# EAGLE design HeartRate Sensor (EAGLE 9.5.1)
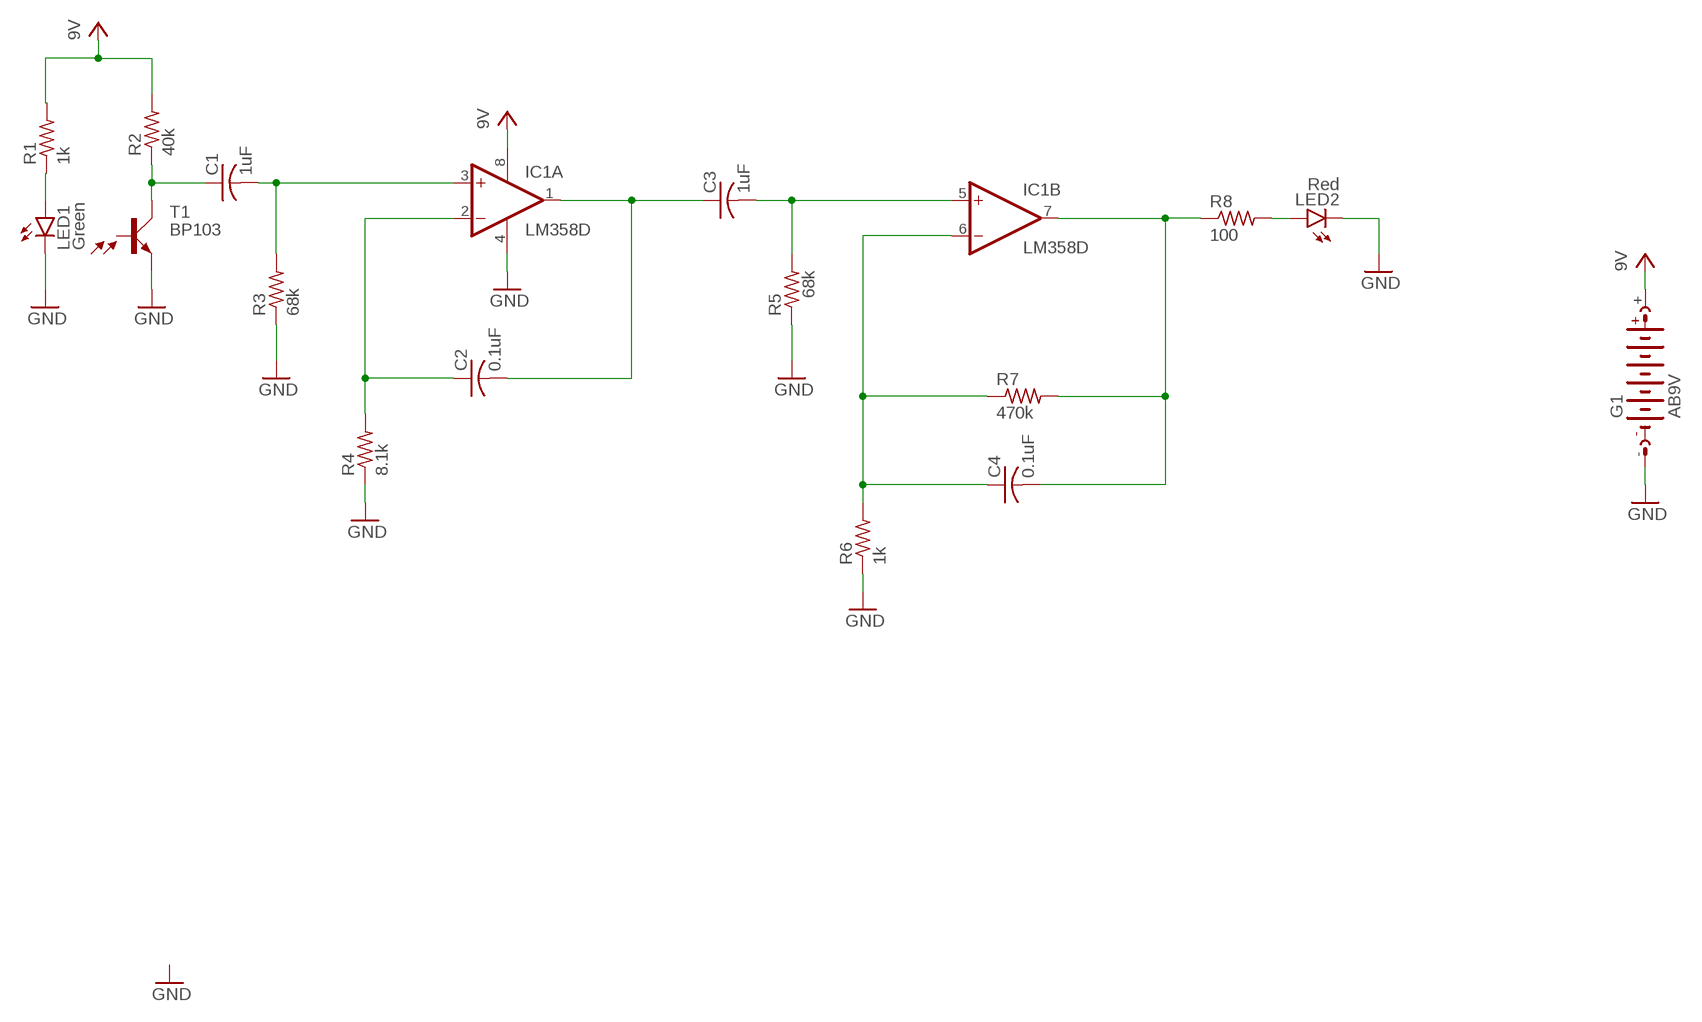
[diagram p0: schematic, sheet 1]

## Parts
C1  1uF  C-USC0805  [C0805]
C2  0.1uF  C-USC0805  [C0805]
C3  1uF  C-USC0805  [C0805]
C4  0.1uF  C-USC0805  [C0805]
G1  AB9V  [AB9V]
IC1  LM358D  [SO08]
LED1  Green  LED  [SMARTLED-TTW]
LED2  Red  LED  [SMARTLED-TTW]
R1  1k  R-US_R0805  [R0805]
R2  40k  R-US_R0805  [R0805]
R3  68k  R-US_R0805  [R0805]
R4  8.1k  R-US_R0805  [R0805]
R5  68k  R-US_R0805  [R0805]
R6  1k  R-US_R0805  [R0805]
R7  470k  R-US_R0805  [R0805]
R8  100  R-US_R0805  [R0805]
T1  BP103  [BP103]

## Nets
GND: G1.- IC1.4(P:V-) LED1.C@1(C) LED2.C@1(C) R3.1 R4.1 R5.1 R6.1 T1.E
N$1: C1.2 IC1.3(A:+IN) R3.2
N$2: C2.1 IC1.2(A:-IN) R4.2
N$3: C3.2 IC1.5(B:+IN) R5.2
N$4: C2.2 C3.1 IC1.1(A:OUT)
N$5: C4.1 IC1.6(B:-IN) R6.2 R7.1
N$6: C4.2 IC1.7(B:OUT) R7.2 R8.1
N$7: LED2.A@1(A) R8.2
N$8: LED1.A@1(A) R1.1
N$9: C1.1 R2.1 T1.C
VCC: G1.+ IC1.8(P:V+) R1.2 R2.2 ; supply symbol labelled 9V
Unconnected: T1.B

## Library data of the parts
C1-C4 = rcl:C-US: CAPACITOR, American symbol; SPICEPREFIX: C
G1 = battery:AB9V: 9-V BATTERY CLIP
IC1 = linear:LM358: OP AMP also LM158; LM258; LM2904 Source: http://cache.national.com/ds/LM/LM158.pdf
LED1 LED2 = led:LED: LED OSRAM: - CHIPLED LG R971, LG N971, LY N971, LG Q971, LY Q971, LO R971, LY R971 LH N974, LH R974 LS Q976, LO Q976, LY Q976 LO Q996 - Hyper CHIPLED LW Q18S LB Q993, LB Q99A, LB R99A - SideLED LS A670, LO A670, LY A670, LG A670, LP A670 LB A673, LV A673, LT A673, LW A673 LH A674 LY A675 LS A676, LA A676, LO A676, LY A676, LW A676 LS A679, LY A679, LG A679 - Hyper Micro SIDELED® LS Y876, LA Y876, LO Y876, LY Y876 LT Y87S - SmartLED LW L88C, LW L88S LB L89C, LB L89S, LG L890 LS L89K, LO L89K, LY L89K LS L896, LA L896, LO L896, LY L896 - TOPLED LS T670, LO T670, LY T670, LG T670, LP T670 LSG T670, LSP T670, LSY T670, LOP T670, LYG T670 LG T671, LOG T671, LSG T671 LB T673, LV T673, LT T673, LW T673 LH T674 LS T676, LA T676, LO T676, LY T676, LB T676, LH T676, LSB T676, LW T676 LB T67C, LV T67C, LT T67C, LS T67K, LO T67K, LY T67K, LW E67C LS E67B, LA E67B, LO E67B, LY E67B, LB E67C, LV E67C, LT E67C LW T67C LS T679, LY T679, LG T679 LS T770, LO T770, LY T770, LG T770, LP T770 LB T773, LV T773, LT T773, LW T773 LH T774 LS E675, LA E675, LY E675, LS T675 LS T776, LA T776, LO T776, LY T776, LB T776 LHGB T686 LT T68C, LB T68C - Hyper Mini TOPLED® LB M676 - Mini TOPLED Santana® LG M470 LS M47K, LO M47K, LY M47K Source: http://www.osram.convergy.de LUXEON: - LUMILED® LXK2-PW12-R00, LXK2-PW12-S00, LXK2-PW14-U00, LXK2-PW14-V00 LXK2-PM12-R00, LXK2-PM12-S00, LXK2-PM14-U00 LXK2-PE12-Q00, LXK2-PE12-R00, LXK2-PE12-S00, LXK2-PE14-T00, LXK2-PE14-U00 LXK2-PB12-K00, LXK2-PB12-L00, LXK2-PB12-M00, LXK2-PB14-N00, LXK2-PB14-P00, LXK2-PB14-Q00 LXK2-PR12-L00, LXK2-PR12-M00, LXK2-PR14-Q00, LXK2-PR14-R00 LXK2-PD12-Q00, LXK2-PD12-R00, LXK2-PD12-S00 LXK2-PH12-R00, LXK2-PH12-S00 LXK2-PL12-P00, LXK2-PL12-Q00, LXK2-PL12-R00 Source: www.luxeon.com KINGBRIGHT: KA-3528ASYC Source: www.kingbright.com
R1-R8 = rcl:R-US_: RESISTOR, American symbol; SPICEPREFIX: R
T1 = opto-trans-siemens:BP103: PHOTO TRANSISTOR; OC_FARNELL: unknown; OC_NEWARK: unknown

## Net classes
0 default: width 0.305 mm, drill 0.508 mm, clearance 0.254 mm

## Board
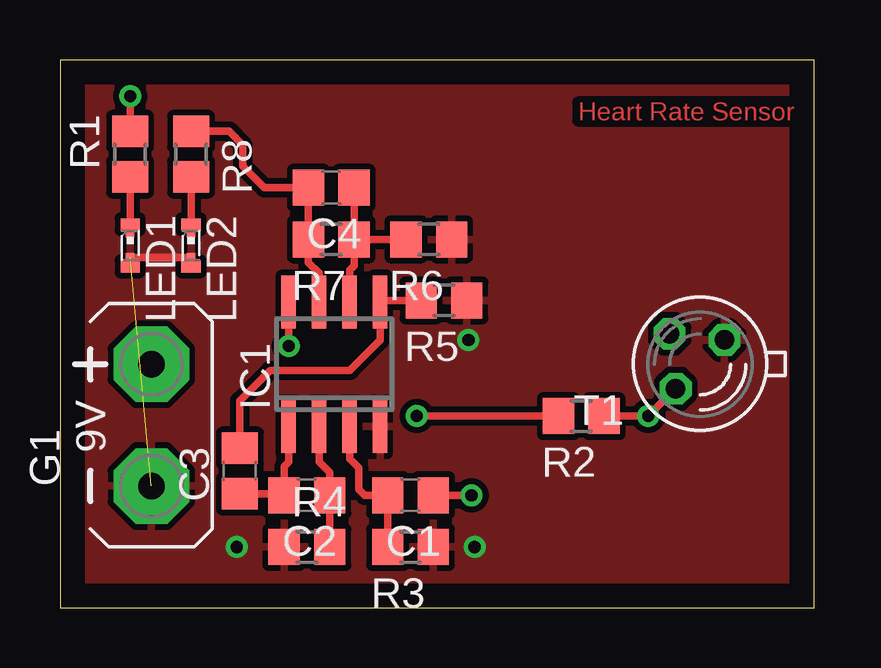
[diagram p1: board, top side]
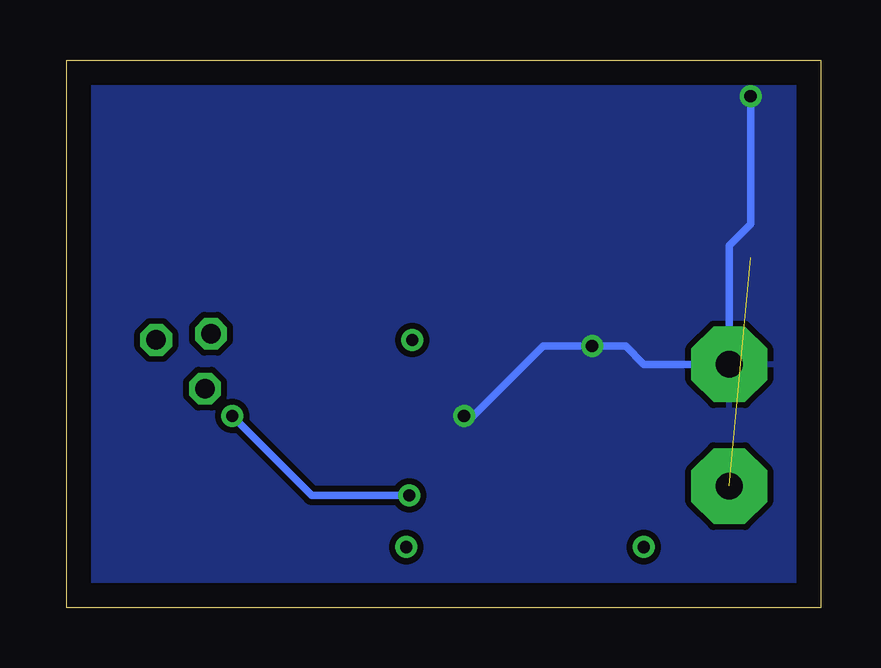
[diagram p2: board, bottom side, seen from below]

Size 31.42 x 22.85 mm. Coordinates in mm from the lower left corner, seen from the top.
Outline: 0,0 31.42,0 31.42,22.85 0,22.85 0,0
Copper layers (1*16): Top 0.035mm / dielectric 1.5mm / Bottom 0.035mm
Design rules "default": minimum track width 6mil, minimum drill 0.35mm, track to track 6mil, track to pad 6mil, pad to pad 6mil, via to via 6mil, smd to smd 6mil, copper to edge 40mil, drill to drill 6mil, minimum pad ring 10mil, minimum via ring 8mil, stop-mask expansion 4mil, vias tented up to drill 0mil, thermal gap 10mil

### Footprints (pad centres in the part's own frame; a part is rotated, then mirrored left to right if it is on the bottom)
C0805 = smd 1.3 x 1.5: 1 -0.95,0; 2 0.95,0
AB9V = drill 1.118 pad 3.15 octagon: + 0,2.54; - 0,-2.54
SO08 = smd 0.6 x 2.2: 1 -1.905,-2.6; 2 -0.635,-2.6; 3 0.635,-2.6; 4 1.905,-2.6; 5 1.905,2.6; 6 0.635,2.6; 7 -0.635,2.6; 8 -1.905,2.6
SMARTLED-TTW = smd 0.8 x 0.5: A 0,-0.875; C 0,0.875 | smd 0.35 x 0.35: A@1 0,-0.5; C@1 0,0.5
R0805 = smd 1.3 x 1.5: 1 -0.95,0; 2 0.95,0
BP103 = drill 0.813 octagon: B 1.27,-1.27; C 1.016,1.016; E -1.016,-1.016

### Placement (x,y rotation side)
C1  14.61,4.7 180 top
C2  10.29,4.7 180 top
C3  7.49,5.71 90 top
C4  11.3,17.53 180 top
G1  3.81,7.62 0 top
IC1  11.43,10.16 0 top
LED1  2.92,15.11 180 top
LED2  5.46,15.11 180 top
R1  2.92,18.92 90 top
R2  21.72,8 180 top
R3  14.61,2.54 180 top
R4  10.29,2.54 0 top
R5  16,12.83 180 top
R6  15.37,15.37 180 top
R7  11.3,15.37 180 top
R8  5.46,18.92 270 top
T1  26.67,10.16 180 top

### Tracks (layer width: path | path; a pad name or v marks a point on that pad's centre or on a via)
GND  (via drill 0.51)  (1 unrouted)
  Top 0.305: LED1.C@1 LED2.C@1
  other vias: 17.02,11.18 17.27,2.54 7.37,2.54
  pour Top: -1.27,24.13 -1.27,-1.27 33.02,-1.27 33.02,24.13
N$1
  Top 0.305: IC1.3 12.06,6.22 12.45,5.84 12.45,4.95 12.7,4.7 C1.2 R3.2
N$2
  Top 0.305: IC1.2 10.79,6.1 11.24,5.65 C2.1 R4.2
N$3
  Top 0.305: C3.2 7.49,8.64 8.76,9.91 12.06,9.91 13.34,11.18 IC1.5 13.4,12.83 R5.2
N$4
  Top 0.305: IC1.1 9.53,6.1 9.34,5.91 C2.2 9.27,4.76 C3.1
N$5
  Top 0.305: C4.1 R7.1 | R7.1 12.25,14.29 12.06,14.1 IC1.6 | R6.2 R7.1
N$6
  Top 0.305: R8.1 7.05,19.87 7.62,19.3 7.62,18.41 8.51,17.53 C4.2 R7.2 10.35,14.41 10.79,13.97 IC1.7
N$7
  Top 0.305: R8.2 LED2.A@1
N$8
  Top 0.305: LED1.A@1 R1.1
N$9  (via drill 0.51)
  Top 0.305: R2.1 v24.51,8 T1.C | v17.14,4.7 C1.1
  Bottom 0.305: v24.51,8 21.21,4.7 v17.14,4.7
VCC  (via drill 0.51)
  Top 0.305: IC1.8 v9.53,10.92 | v14.86,8 R2.2 | v2.92,21.34 R1.2
  Bottom 0.305: v14.86,8 14.48,8 11.56,10.92 v9.53,10.92 8.13,10.92 7.37,10.16 G1.+ 3.81,15.11 2.92,16 v2.92,21.34
  pour Bottom: -2.54,24.13 -2.54,-2.54 34.29,-2.54 34.29,25.4 -2.54,25.4

### Text on the board
Top: Heart Rate Sensor